# EAGLE design graf_led_driver_1 (EAGLE 5.12)
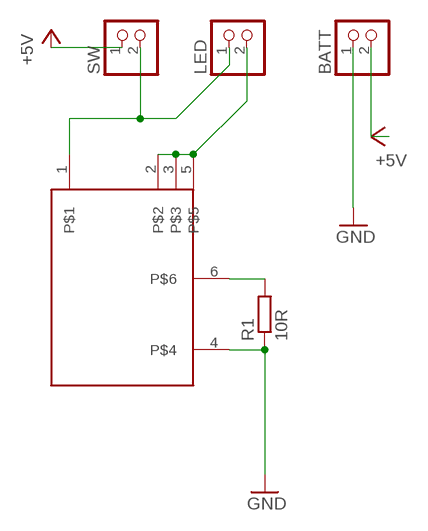
[diagram p0: schematic, sheet 1]

## Parts
BATT  PINHD-1X2/90  [1X02/90]
BCR421U  BCR421U  [SC74_INFINEON]
LED  PINHD-1X2/90  [1X02/90]
R1  10R  R-EU_R0805  [R0805]
SW  PINHD-1X2/90  [1X02/90]

## Nets
+5V: BATT.2 SW.1
GND: BATT.1 BCR421U.4 R1.1
LED+: BCR421U.1 LED.1 SW.2
N$2: BCR421U.2 BCR421U.3 BCR421U.5 LED.2
N$4: BCR421U.6 R1.2

## Library data of the parts
BATT LED SW = pinhead:PINHD-1X2: PIN HEADER
BCR421U = matt:BCR421U
R1 = matt rcl:R-EU_: RESISTOR, European symbol

## Board
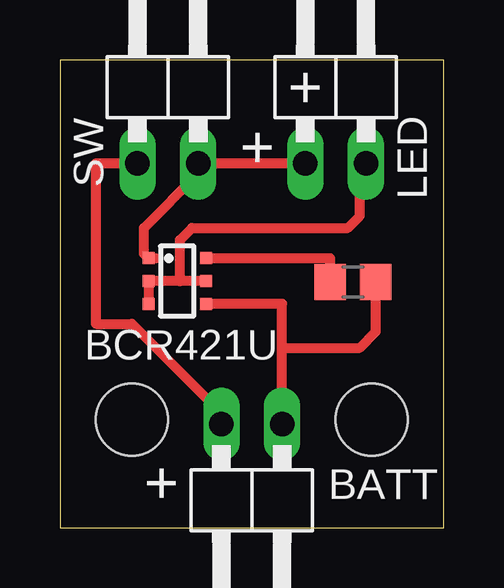
[diagram p1: board, top side]

Size 16 x 19.5 mm. Coordinates in mm from the lower left corner, seen from the top.
Outline: 0,0 16,0 16,19.5 0,19.5 0,0
Copper layers (1*16): Top 0.035mm / dielectric 1.5mm / Bottom 0.035mm
Design rules "default": minimum track width 10mil, minimum drill 24mil, track to track 8mil, track to pad 8mil, pad to pad 8mil, via to via 8mil, smd to smd 8mil, copper to edge 40mil, drill to drill 8mil, minimum pad ring 10mil, minimum via ring 8mil, stop-mask expansion 4mil, vias tented up to drill 0mil, thermal gap 10mil
Holes 3 mm at 3,4.5 13,4.5

### Footprints (pad centres in the part's own frame; a part is rotated, then mirrored left to right if it is on the bottom)
1X02/90 = drill 1.016 long: 1 -1.27,-3.81; 2 1.27,-3.81
SC74_INFINEON = smd 0.5 x 0.5: 1 -0.95,-1.2; 2 0,-1.2; 3 0.95,-1.2; 4 0.95,1.2; 5 0,1.2; 6 -0.95,1.2
R0805 = smd 1.3 x 1.5: 1 -0.95,0; 2 0.95,0

### Placement (x,y rotation side)
BATT  8,0.5 180 top
BCR421U  4.89,10.28 270 top
LED  11.5,19 0 top
R1  12.22,10.24 180 top
SW  4.5,19 0 top

### Tracks (layer width: path | path; a pad name or v marks a point on that pad's centre or on a via)
+5V
  Top 0.406: SW.1 1.5,15.19 1.5,8.5 3,8.5 6.5,5 6.5,4.54 BATT.2
  Top 1.016: BATT.2 6.73,4
GND
  Top 0.406: BCR421U.4 9.27,9.33 9.27,7.5 | BATT.1 9.27,7.5 | R1.1 13.17,8.17 12.5,7.5 9.27,7.5
LED+
  Top 0.406: 4,11.23 BCR421U.1 3.5,11.42 3.5,12.5 5.77,14.77 SW.2 LED.1
N$2
  Top 0.406: BCR421U.3 BCR421U.2 5,10.28 | BCR421U.5 5,10.28 | LED.2 12.5,15.19 12.5,13 12,12.5 5.5,12.5 5,12 5,10.28
N$4
  Top 0.406: BCR421U.6 11.27,11.23 R1.2

### Text on the board
tNames: + | + | +
bNames: FRIC-020-DRVR | 8==)- - -